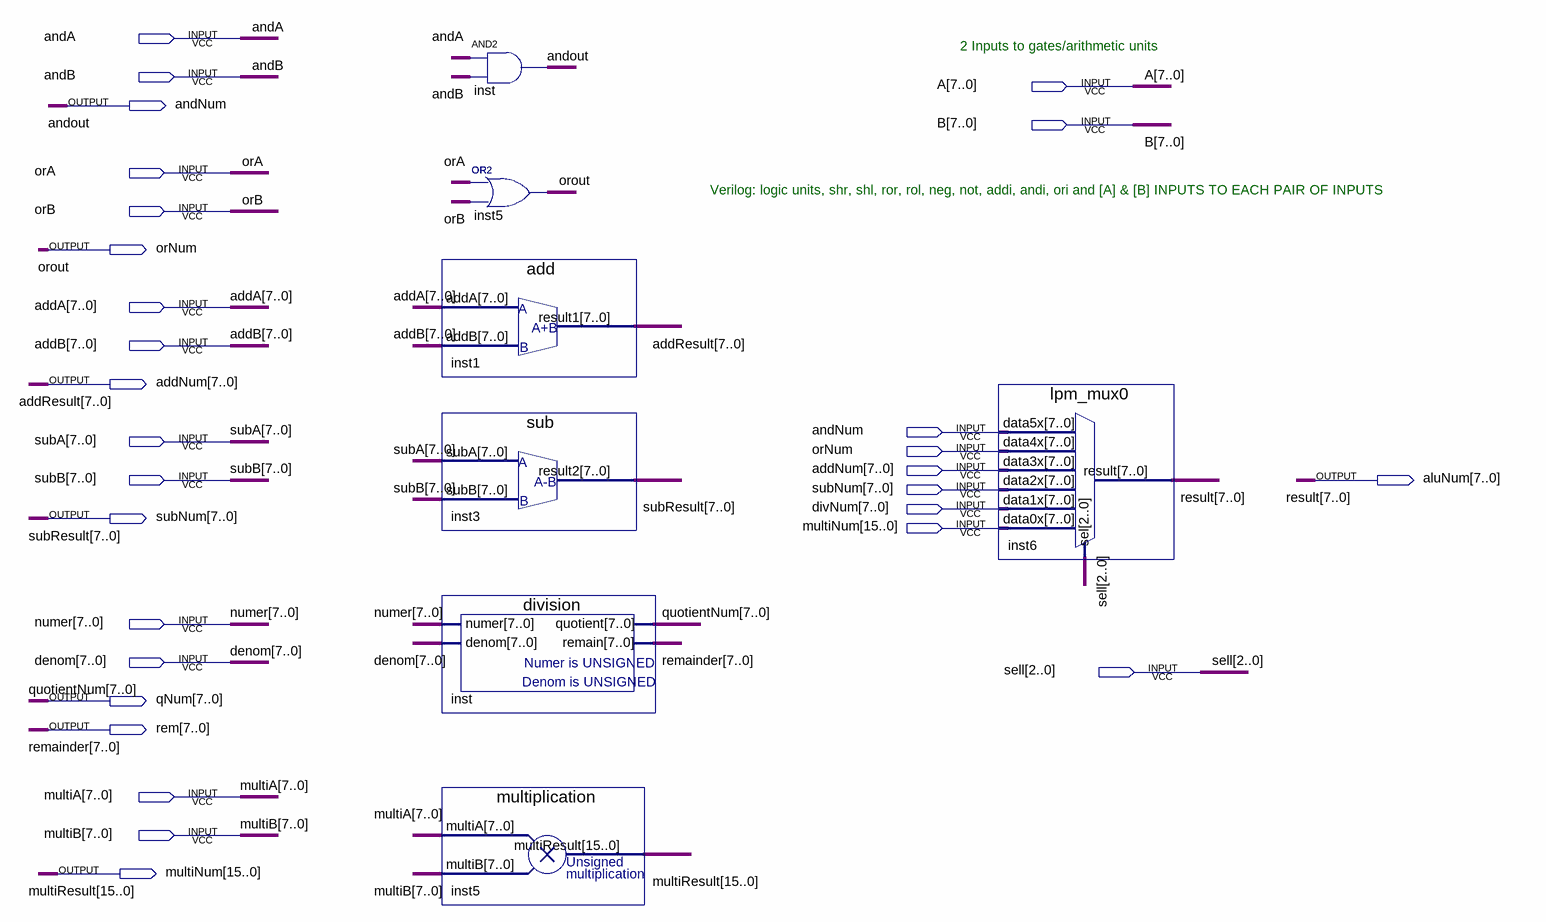
[diagram p0: schematic sheet]
// Quartus schematic ALU.bdf as structural Verilog: 7 symbols, 29 pins
module ALU (
  input  andA,
  input  andB,
  input  [7:0] A,
  input  [7:0] B,
  input  orA,
  input  orB,
  input  [7:0] addA,
  input  [7:0] addB,
  inout  andNum,
  input  [7:0] subA,
  inout  orNum,
  inout  [7:0] addNum,
  input  [7:0] subB,
  inout  [7:0] subNum,
  input  [7:0] divNum,
  inout  [15:0] multiNum,
  input  [7:0] numer,
  input  [7:0] denom,
  input  [2:0] sell,
  input  [7:0] multiA,
  input  [7:0] multiB,
  output [7:0] aluNum,
  output [7:0] qNum,
  output [7:0] rem
);

  wire [7:0] undriven, undriven_2;

  and inst (andNum, andA, andB);
  or inst5 (orNum, orA, orB);
  add inst1 (.addA(addA), .addB(addB), .result1(addNum));
  sub inst3 (.subA(subA), .subB(subB), .result2(subNum));
  division inst_dup2 (.numer(numer), .denom(denom), .quotient(qNum), .remain(rem));
  multiplication inst5_dup2 (.multiA(multiA), .multiB(multiB), .multiResult(multiNum));
  lpm_mux0 inst6 (
    .data5x(undriven), .data4x(undriven_2), .data3x(addNum), .data2x(subNum), .data1x(divNum),
    .data0x(multiNum), .sel(sell), .result(aluNum));

  // Other names for the same wires on the sheet: addResult[7:0] = addNum; andout = andNum;
  //   multiResult[15:0] = multiNum; orout = orNum; quotientNum[7:0] = qNum; remainder[7:0] = rem;
  //   result[7:0] = aluNum; subResult[7:0] = subNum

  // Notes on the sheet:
  //   2 Inputs to gates/arithmetic units
  //   Verilog: logic units, shr, shl, ror, rol, neg, not, addi, andi, ori and [A] & [B] INPUTS TO EACH PAIR OF INPUTS
endmodule
